# EAGLE board 1907022249-Dev Board (EAGLE 9.4.2)
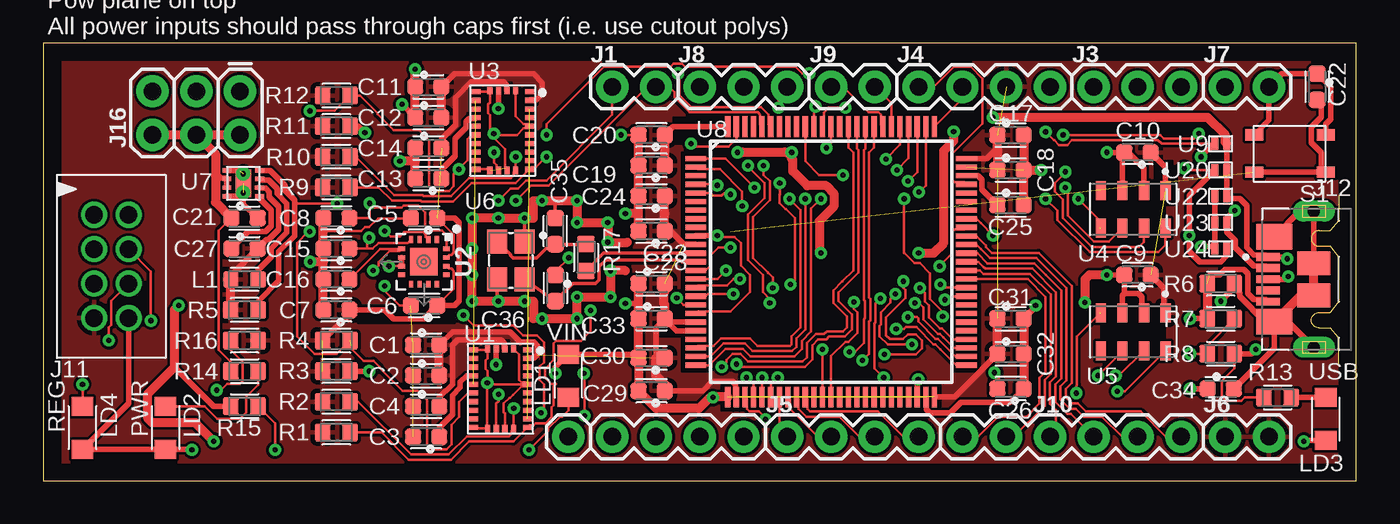
[diagram p3: board, top side]
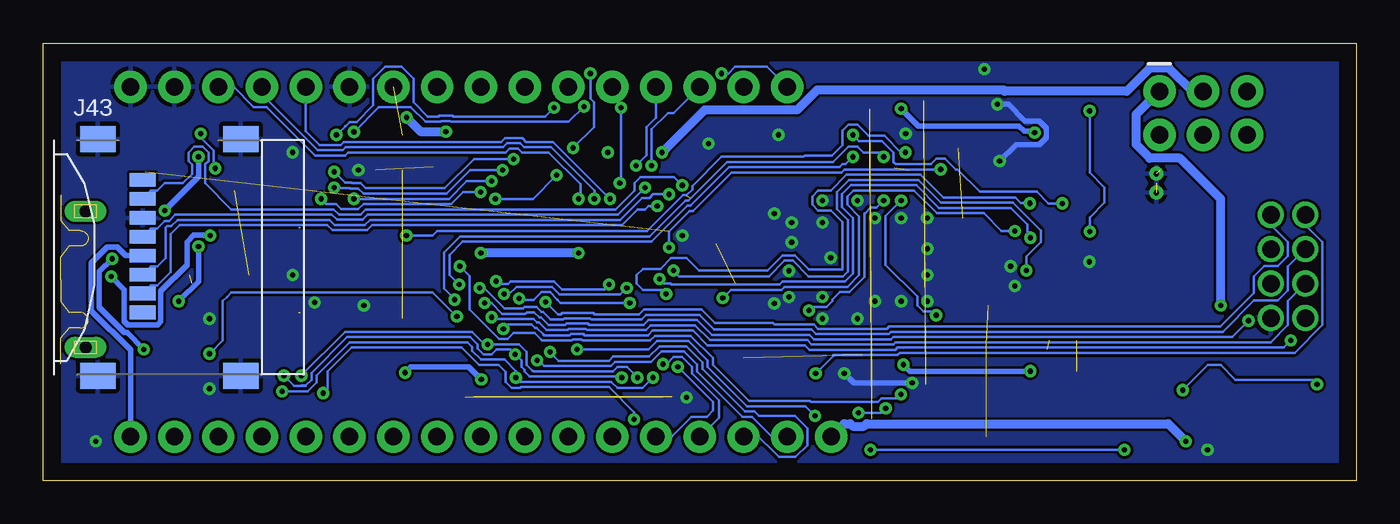
[diagram p4: board, bottom side, seen from below]

Size 76.2 x 25.4 mm. Coordinates in mm from the lower left corner, seen from the top.
Outline: 0,0 76.2,0 76.2,25.4 0,25.4 0,0
Copper layers (1*16): Top 0.035mm / dielectric 1.5mm / Bottom 0.035mm
Design rules "default *": minimum track width 6mil, minimum drill 0.3mm, track to track 6mil, track to pad 6mil, pad to pad 6mil, via to via 6mil, smd to smd 6mil, copper to edge 40mil, drill to drill 6mil, minimum pad ring 10mil, minimum via ring 8mil, stop-mask expansion 4mil, vias tented up to drill 0mil, thermal gap 10mil

## Footprints (pad centres in the part's own frame; a part is rotated, then mirrored left to right if it is on the bottom)
CAPC1608X95N = smd 0.95 x 0.97: 1 -0.76,0; 2 0.76,0
1X02 = drill 1.016 pad 1.88: 1 0,0; 2 2.54,0
1X04 = drill 1.016 pad 1.88: 1 0,0; 2 2.54,0; 3 5.08,0; 4 7.62,0
1X03 = drill 1.016 pad 1.88: 1 0,0; 2 2.54,0; 3 5.08,0
1X06 = drill 1.016 pad 1.88: 1 0,0; 2 2.54,0; 3 5.08,0; 4 7.62,0; 5 10.16,0; 6 12.7,0
87831-0819 = drill 1.016: 1 8.325,4.15; 2 6.325,4.15; 3 4.325,4.15; 4 2.325,4.15; 5 8.325,2.15; 6 6.325,2.15; 7 4.325,2.15; 8 2.325,2.15
MOLEX_105164-0001 = smd 0.45 x 1.38: 1 1.3,4.11; 2 0.65,4.11; 3 0,4.11; 4 -0.65,4.11; 5 -1.3,4.11 | drill 0.7 long: SH1 -3.95,1.45; SH6 3.95,1.45 | smd 1.475 x 2.1: SH2 -2.462,3.75; SH5 2.462,3.75 | smd 1.375 x 1.9: SH3 -0.938,1.45; SH4 0.938,1.45
1X01 = drill 1.016 pad 1.88: 1 0,0
2X3 = drill 1.016 pad 1.88: 1 0,0; 2 0,2.54; 3 2.54,0; 4 2.54,2.54; 5 5.08,0; 6 5.08,2.54
MOLEX_47219-2001 = smd 0.8 x 1.5: 1 3.2,-2.1; 2 2.1,-2.1; 3 1,-2.1; 4 -0.1,-2.1; 5 -1.2,-2.1; 6 -2.3,-2.1; 7 -3.4,-2.1; 8 -4.5,-2.1 | smd 1.5 x 2.05: G1 6.875,-4.7; G2 6.875,3.6; G3 -6.875,3.6; G4 -6.875,-4.7
INDC1608X95N = smd 0.9 x 0.97: 1 -0.785,0; 2 0.785,0
0805_LED = smd 1.1 x 1.25: A 0,0; C 2.5,0
RESC1608X50N = smd 0.94 x 1.02: 1 -0.79,0; 2 0.79,0
SKRPANE010 = smd 1.05 x 0.65: 1 0,2.15; 2 4.15,2.15; 3 0,0; 4 4.15,0
LGA28R50P4X10_380X520X100 = smd 0.3 x 0.525: 1 -2.25,1.562; 6 -2.25,-1.562; 7 -1.75,-1.562; 8 -1.25,-1.562; 9 -0.75,-1.562; 10 -0.25,-1.562; 11 0.25,-1.562; 12 0.75,-1.562; 13 1.25,-1.562; 14 1.75,-1.562; 15 2.25,-1.562; 20 2.25,1.562; 21 1.75,1.562; 22 1.25,1.562; 23 0.75,1.562; 24 0.25,1.562; 25 -0.25,1.562; 26 -0.75,1.562; 27 -1.25,1.562; 28 -1.75,1.562 | smd 0.425 x 0.3: 2 -2.312,0.75; 3 -2.312,0.25; 4 -2.312,-0.25; 5 -2.312,-0.75; 16 2.312,-0.75; 17 2.312,-0.25; 18 2.312,0.25; 19 2.312,0.75
LFCSP-16-3X3 = smd 0.4 x 0.25: 1 -1.3,0.75; 2 -1.3,0.25; 3 -1.3,-0.25; 4 -1.3,-0.75; 9 1.3,-0.75; 10 1.3,-0.25; 11 1.3,0.25; 12 1.3,0.75 | smd 0.25 x 0.4: 5 -0.75,-1.3; 6 -0.25,-1.3; 7 0.25,-1.3; 8 0.75,-1.3; 13 0.75,1.3; 14 0.25,1.3; 15 -0.25,1.3; 16 -0.75,1.3 | smd 1.6 x 1.6: EXP 0,0
TE_MS860702BA01-50 = smd 1.1 x 0.6: 1 -1.1,1.875; 2 -1.1,0.625; 3 -1.1,-0.625; 4 -1.1,-1.875; 5 1.1,-1.875; 6 1.1,-0.625; 7 1.1,0.625; 8 1.1,1.875
TSX-3225 = smd 1.4 x 1.15: 1 0,0; 2 2.2,0; 3 2.2,1.6; 4 0,1.6
TPS62172 = smd 0.5 x 0.25: 1 -0.01,1.5; 2 -0.01,1; 3 -0.01,0.5; 4 -0.01,0; 5 1.9,0; 6 1.9,0.5; 7 1.9,1; 8 1.9,1.5 | smd 0.9 x 1.6: THERMAL@1 0.95,0.75 | drill 0.3: THERMAL@2 0.95,1.3; THERMAL@3 0.95,0.2
LQFP100_14X14 = smd 1.2 x 0.3: 1 -7.85,6; 2 -7.85,5.5; 3 -7.85,5; 4 -7.85,4.5; 5 -7.85,4; 6 -7.85,3.5; 7 -7.85,3; 8 -7.85,2.5; 9 -7.85,2; 10 -7.85,1.5; 11 -7.85,1; 12 -7.85,0.5; 13 -7.85,0; 14 -7.85,-0.5; 15 -7.85,-1; 16 -7.85,-1.5; 17 -7.85,-2; 18 -7.85,-2.5; 19 -7.85,-3; 20 -7.85,-3.5; 21 -7.85,-4; 22 -7.85,-4.5; 23 -7.85,-5; 24 -7.85,-5.5; 25 -7.85,-6; 51 7.85,-6; 52 7.85,-5.5; 53 7.85,-5; 54 7.85,-4.5; 55 7.85,-4; 56 7.85,-3.5; 57 7.85,-3; 58 7.85,-2.5; 59 7.85,-2; 60 7.85,-1.5; 61 7.85,-1; 62 7.85,-0.5; 63 7.85,0; 64 7.85,0.5; 65 7.85,1; 66 7.85,1.5; 67 7.85,2; 68 7.85,2.5; 69 7.85,3; 70 7.85,3.5; 71 7.85,4; 72 7.85,4.5; 73 7.85,5; 74 7.85,5.5; 75 7.85,6 | smd 0.3 x 1.2: 26 -6,-7.85; 27 -5.5,-7.85; 28 -5,-7.85; 29 -4.5,-7.85; 30 -4,-7.85; 31 -3.5,-7.85; 32 -3,-7.85; 33 -2.5,-7.85; 34 -2,-7.85; 35 -1.5,-7.85; 36 -1,-7.85; 37 -0.5,-7.85; 38 0,-7.85; 39 0.5,-7.85; 40 1,-7.85; 41 1.5,-7.85; 42 2,-7.85; 43 2.5,-7.85; 44 3,-7.85; 45 3.5,-7.85; 46 4,-7.85; 47 4.5,-7.85; 48 5,-7.85; 49 5.5,-7.85; 50 6,-7.85; 76 6,7.85; 77 5.5,7.85; 78 5,7.85; 79 4.5,7.85; 80 4,7.85; 81 3.5,7.85; 82 3,7.85; 83 2.5,7.85; 84 2,7.85; 85 1.5,7.85; 86 1,7.85; 87 0.5,7.85; 88 0,7.85; 89 -0.5,7.85; 90 -1,7.85; 91 -1.5,7.85; 92 -2,7.85; 93 -2.5,7.85; 94 -3,7.85; 95 -3.5,7.85; 96 -4,7.85; 97 -4.5,7.85; 98 -5,7.85; 99 -5.5,7.85; 100 -6,7.85
SOD882 = smd 0.4 x 0.7: 1 -0.35,0; 2 0.35,0

## Placement (x,y rotation side)
C1  120nF  [CAPC1608X95N]  22.23,7.87 0 top
C2  6.8nF  [CAPC1608X95N]  22.23,6.1 0 top
C3  100nF  [CAPC1608X95N]  22.23,2.54 180 top
C4  100nF  [CAPC1608X95N]  22.23,4.32 0 top
C5  100nF  [CAPC1608X95N]  22.1,15.24 180 top
C6  100nF  [CAPC1608X95N]  22.1,10.16 180 top
C7  10uF  [CAPC1608X95N]  17.02,9.91 180 top
C8  .005uF  [CAPC1608X95N]  17.02,15.24 180 top
C9  100nF  [CAPC1608X95N]  63.5,11.94 180 top
C10  100nF  [CAPC1608X95N]  63.5,19.05 180 top
C11  120nF  [CAPC1608X95N]  22.35,22.86 0 top
C12  6.8nF  [CAPC1608X95N]  22.35,21.08 0 top
C13  100nF  [CAPC1608X95N]  22.35,17.53 180 top
C14  100nF  [CAPC1608X95N]  22.35,19.3 0 top
C15  .005uF  [CAPC1608X95N]  17.02,13.46 180 top
C16  .005uF  [CAPC1608X95N]  17.02,11.68 180 top
C17  100nF  [CAPC1608X95N]  56.13,20.07 0 top
C18  4.7uF  [CAPC1608X95N]  56.13,18.03 0 top
C19  100nF  [CAPC1608X95N]  35.31,18.29 180 top
C20  4.7uF  [CAPC1608X95N]  35.31,20.07 180 top
C21  10 uF  [CAPC1608X95N]  11.68,15.24 0 top
C22  100nF  [CAPC1608X95N]  73.91,22.86 270 top
C23  100nF  [CAPC1608X95N]  35.31,14.48 180 top
C24  4.7uF  [CAPC1608X95N]  35.31,16.51 180 top
C25  2.2uF  [CAPC1608X95N]  56.13,16 0 top
C26  2.2uF  [CAPC1608X95N]  56.13,5.33 180 top
C27  22uF  [CAPC1608X95N]  11.68,13.46 0 top
C28  1uF  [CAPC1608X95N]  35.31,11.43 0 top
C29  100nF  [CAPC1608X95N]  35.31,5.21 180 top
C30  4.7uF  [CAPC1608X95N]  35.31,7.11 180 top
C31  100nF  [CAPC1608X95N]  56.13,9.4 0 top
C32  4.7uF  [CAPC1608X95N]  56.13,7.37 0 top
C33  10nF  [CAPC1608X95N]  35.31,9.4 0 top
C34  4.7nF  [CAPC1608X95N]  68.33,5.33 0 top
C35  8pF  [CAPC1608X95N]  29.72,14.48 90 top
C36  8pF  [CAPC1608X95N]  29.72,11.18 270 top
J1  I2C1  [1X02]  33.02,22.86 0 top
J2  P0-P3  [1X04]  33.02,2.54 0 top
J3  A0-A3  [1X03]  60.96,22.86 0 top
J4  Debug  [1X04]  50.8,22.86 0 top
J5  P4-P7  [1X04]  43.18,2.54 0 top
J6  VCC  [1X02]  68.58,2.54 0 top
J7  GND  [1X02]  68.58,22.86 0 top
J8  SPI1  [1X03]  38.1,22.86 0 top
J9  UART5  [1X02]  45.72,22.86 0 top
J10  P8-P13  [1X06]  53.34,2.54 0 top
J11  [87831-0819]  7.11,7.11 90 top
J12  105164-0001  [MOLEX_105164-0001]  75.18,11.68 90 top
J13  VIN  [1X01]  30.48,2.54 0 top
J16  Header 3x2  [2X3]  11.43,22.61 180 top
J43  47219-2001  [MOLEX_47219-2001]  68.33,12.95 270 bottom
L1  2.2uH  [INDC1608X95N]  11.68,11.68 180 top
LD1  VIN  [0805_LED]  30.48,4.83 90 top
LD2  PWR  [0805_LED]  7.11,4.32 270 top
LD3  USB  [0805_LED]  74.42,4.83 270 top
LD4  REG  [0805_LED]  2.29,4.32 270 top
R1  40kΩ  [RESC1608X50N]  17.02,2.79 180 top
R2  40kΩ  [RESC1608X50N]  17.02,4.57 180 top
R3  10kΩ  [RESC1608X50N]  17.02,6.35 180 top
R4  10kΩ  [RESC1608X50N]  17.02,8.13 180 top
R5  100k  [RESC1608X50N]  11.68,9.91 180 top
R6  1M  [RESC1608X50N]  68.33,11.43 180 top
R7  59k  [RESC1608X50N]  68.33,9.4 0 top
R8  42.2k  [RESC1608X50N]  68.33,7.37 0 top
R9  40kΩ  [RESC1608X50N]  17.02,17.02 180 top
R10  40kΩ  [RESC1608X50N]  17.02,18.8 180 top
R11  10kΩ  [RESC1608X50N]  17.02,20.57 180 top
R12  10kΩ  [RESC1608X50N]  17.02,22.35 180 top
R13  [RESC1608X50N]  71.63,4.83 0 top
R14  [RESC1608X50N]  11.68,6.35 0 top
R15  [RESC1608X50N]  11.68,4.32 0 top
R16  [RESC1608X50N]  11.68,8.13 180 top
R17  [RESC1608X50N]  31.5,12.95 270 top
S1  SKRPANE010  [SKRPANE010]  74.42,20.07 180 top
U1  BNO055  [LGA28R50P4X10_380X520X100]  26.54,5.33 270 top
U2  ADXL377  [LFCSP-16-3X3]  22.1,12.7 270 top
U3  BNO055  [LGA28R50P4X10_380X520X100]  26.67,20.32 270 top
U4  MS5607-02BA03  [TE_MS860702BA01-50]  63.25,15.75 270 top
U5  MS5607-02BA03  [TE_MS860702BA01-50]  63.25,8.64 270 top
U6  TSX-3225  [TSX-3225]  27.94,11.68 90 top
U7  TPS62172  [TPS62172]  10.67,16.51 0 top
U8  STM32F767VIT6  [LQFP100_14X14]  45.72,12.7 0 top
U9  PESD3V3S1UL  [SOD882]  68.33,19.56 0 top
U20  PESD3V3S1UL  [SOD882]  68.33,18.03 0 top
U22  PESD3V3S1UL  [SOD882]  68.33,16.51 0 top
U23  PESD3V3S1UL  [SOD882]  68.33,14.99 0 top
U24  PESD3V3S1UL  [SOD882]  68.33,13.46 0 top

## Tracks (layer width: path | path; a pad name or v marks a point on that pad's centre or on a via)
3V3  (8 unrouted)
  Top 0.152: C30.1 35.56,7.11 35.76,7.11 | 40.13,4.76 U8.27 | C5.1 | U2.15 23.54,13.1 23.69,13.1 23.83,13.23 23.83,14.27 23.11,14.99 | U2.14 23.54,12.3 23.69,12.3 23.83,12.17 23.83,11.13 C6.1 | C7.1 17.78,9.68
  Top 0.203: 39.72,20.99 U8.100
  Top 0.305: C9.1 64.77,11.43 65.02,11.18 65.02,9.83 U5.1 | 36.41,14.48 C23.1 36.41,14.48 | C33.2 36.26,9.2 U8.20 | C33.2 36.76,8.7 U8.21 | U8.27 40.18,4.89 40.18,5.57 40,5.75 38.83,5.75 38.28,5.21 C29.1 | C32.1 54.48,6.47 54.48,6.42 52.9,4.85 U8.50 | 55.37,19.3 54.77,18.7 U8.75 | U8.11 37.83,13.74 37.15,13.74 36.41,14.48 | C20.1 36.55,20.55 U8.100 | C14.2 23.11,19.81 23.93,20.63 23.93,22.24 24.84,23.15 26.7,23.15 26.88,22.97 26.88,22.68 U3.3 | U1.3 26.75,7.69 26.75,7.99 26.57,8.16 24.72,8.16 24.04,8.16 23.75,7.87 23.75,5.59 22.98,4.82 C4.2 | C1.2 23.75,8.64 27.1,8.64 27.71,8.03 27.72,8.04 28.49,8.04 28.67,7.86 28.67,7.31 28.59,7.22 28.49,7.13 28.15,7.13 U1.28 | C11.2 23.87,23.62 28.45,23.62 28.96,23.11 28.96,22.45 28.62,22.11 28.28,22.11 U3.28 | C5.1 | 23.11,14.99 C5.1 | C5.1 | 12.57,16.98 12.9,16.98 13.12,16.76 13.12,16.46 13.68,15.9 13.68,14.58 13.1,13.99 12.97,13.99 C27.2 10.9,11.92 L1.2 | U4.1 65.12,18.19 C10.1 | R4.2 17.78,9.68 C7.1 19.81,9.91 20.35,9.37 22.07,9.37 C6.1 23.88,10.16 24.13,10.41 24.13,14.99 23.88,15.24 C5.1 | C33.2 35.56,8.89 35.56,7.11
  Top 0.508: C29.1 36.07,5.59 35.56,6.1 35.56,7.11 | C32.1 C31.1 | C18.1 55.37,19.3 C17.1 | C20.1 C19.1 | C23.1 36.07,15.49 C24.1 | C12.2 C11.2 | C2.2 C1.2 | R5.2 L1.2 | C28.2 36.07,10.97 36.01,10.91 36.01,10.28 36.07,10.22 C33.2
  Bottom 0.305: J43.4 71.41,13.05 71.91,13.56 72.48,13.56 73.39,12.65 73.39,9.85 71.12,7.57 J6.2
  pour Top: 1.02,24.64 75.44,24.64 75.44,0.76 1.02,0.76
A0_PA1  (via drill 0.3)
  Top 0.152: v43.31,16.36 43.94,15.72 43.94,8.9 43.41,8.37 43.41,7.9 43.34,7.82 41.45,7.82 41.02,8.25 39.34,8.25 38.91,7.82 37.99,7.82 U8.23
  Bottom 0.152: v43.31,16.36 46.61,19.66 48.16,19.66 48.39,19.89 49.4,19.89 49.62,19.66 58.77,19.66 58.94,19.48 60.15,19.48 60.96,20.3 J3.1
A1_PA2  (via drill 0.3)
  Top 0.152: v44.22,16.36 44.25,16.32 44.25,8.77 43.72,8.24 43.72,7.77 43.46,7.52 41.16,7.52 40.73,7.95 39.47,7.95 38.72,7.2 U8.24
  Bottom 0.152: J3.2 63.5,22.4 60.28,19.18 58.81,19.18 58.64,19.36 49.5,19.36 49.27,19.58 48.52,19.58 48.29,19.36 46.74,19.36 44.22,16.83 v44.22,16.36
A2_PA3  (via drill 0.3)
  Top 0.152: v45.12,16.36 44.55,15.78 44.55,8.64 44.02,8.11 44.02,7.65 43.59,7.21 41.03,7.21 40.6,7.64 39.59,7.64 38.79,6.84 38.79,6.6 38.7,6.7 U8.25
  Bottom 0.152: J3.3 65.15,22.86 63.98,21.69 63.22,21.69 60.4,18.88 58.69,18.88 58.51,19.05 49.37,19.05 49.15,19.28 48.64,19.28 48.42,19.05 46.86,19.05 45.02,17.21 45.02,16.46 v45.12,16.36
ADRSEL1_PA8  (via drill 0.3)
  Top 0.152: v52.02,12.45 52.74,13.17 52.74,14.45 52.88,14.58 53.45,14.58 U8.67 | v26.43,5 26.43,4.61 26.29,4.47 U1.17
  Bottom 0.152: 51.46,11.13 51.46,11.18 | 51.46,11.18 51.46,11.89 v52.02,12.45 | 47.32,8.2 47.25,8.13 | 47.25,8.13 45.53,8.13 45.45,8.2 44.97,8.2 44.9,8.13 40.98,8.13 40.7,8.4 38.63,8.4 37.34,7.12 37.34,6.72 35.24,4.62 31.7,4.62 31.65,4.57 27.77,4.57 27.55,4.78 26.65,4.78 v26.43,5 | 47.25,8.13 47.69,8.56 48.91,8.56 49.26,8.22 49.74,8.22 51.46,9.94 51.46,11.18
ADRSEL2_PA9  (via drill 0.3)
  Top 0.152: v55.12,14.22 54.4,14.94 54.4,14.95 54.14,15.2 U8.68 | U3.17 26.3,18.13 26.3,18.32 26.16,18.45 v26.16,19.05
  Bottom 0.152: v55.12,14.22 53.59,14.22 53.34,14.48 41.15,14.48 39.06,16.56 38.88,16.56 38.53,16.9 38.53,17.09 36.83,18.8 32.08,18.8 32,18.87 30.42,18.87 29.82,19.48 29.82,20.32 29.46,20.67 28.96,20.67 28.3,20.01 27.39,20.01 26.43,19.05 v26.16,19.05
BL_IND  (1 unrouted)
CS1_PA4  (via drill 0.3)  (1 unrouted)
  Top 0.152: v41.91,3.56 41.91,3.66 41.55,4.02 40.98,4.02 40.84,4.16 40.84,4.73 U8.28 | v59.94,5.08 59.94,5.51 59.99,5.56 59.99,8.38 61.3,9.68 61.3,9.74
  Bottom 0.152: v59.94,5.08 59.69,5.33 59.69,6.33 58.3,7.72 51.91,7.72 50.91,6.71 49.78,6.71 49.38,6.31 49.38,5.73 49.02,5.37 48.52,5.37 48.45,5.44 43.37,5.44 41.91,3.97 v41.91,3.56
CS2_PB12  (via drill 0.3)
  Top 0.152: J11.7 3.95,10.43 3.95,9.03 3.81,8.88 v3.81,8.13 | U8.51 52.99,6.7 52.07,7.62 51.77,7.92 51.66,7.92 50.66,8.91 50.06,8.91 49.95,8.8 v49.49,8.8
  Bottom 0.152: v3.81,8.13 4.22,7.72 26.62,7.72 26.75,7.6 31.73,7.6 31.99,7.85 37.64,7.85 38.5,8.71 40.83,8.71 41.1,8.43 44.77,8.43 44.84,8.51 45.58,8.51 45.66,8.43 47.12,8.43 47.2,8.5 47.56,8.87 47.66,8.87 47.87,9.07 49.22,9.07 v49.49,8.8
CS3_PA15  (via drill 0.3)  (1 unrouted)
  Top 0.152: v50.82,16.74 51.22,17.14 U8.77 | v60.07,16.36 61.3,15.13 61.3,14.65
  Bottom 0.152: v50.82,16.74 51.84,16.74 52.53,16.05 57.61,16.05 57.91,15.75 58.9,15.75 59.2,16.05 59.77,16.05 v60.07,16.36
CS4_PE3  (via drill 0.3)
  Top 0.152: 37.99,18.08 U8.2 37.99,18.08 | 37.99,18.08 39.27,18.08 40.56,16.79 v40.56,15.93
  Bottom 0.152: J43.2 69.95,11.32 69.58,11.32 68.78,12.12 68.78,14.32 68.27,14.83 59.71,14.83 59.41,14.53 57.41,14.53 57.11,14.83 42.6,14.83 41.7,15.72 41.28,15.72 41.07,15.93 v40.56,15.93
CUTOUT
  cutout Top: 37.08,19.05 38.73,19.05 38.73,6.35 37.08,6.35
  cutout Top: 25.53,20.83 25.53,21.34 24.64,21.34 24.64,20.83
  cutout Top: 18.29,10.16 21.59,10.16 22.35,10.92 22.86,10.92 23.11,11.18 23.11,14.22 22.86,14.48 22.1,14.48 22.1,16 24.64,16 24.64,9.91 23.88,9.14 18.29,9.14
  cutout Top: 65.53,16 64.52,16 64.52,17.53 64.52,18.03 64.52,18.29 64.77,18.54 65.53,18.54 65.53,18.03 65.79,17.78 65.79,17.53 65.79,16
  cutout Top: 38.61,8.38 38.61,9.4 36.83,9.4 36.83,10.92 35.81,10.92 35.81,8.38
  cutout Top (isolate 0.254): 39.37,21.08 36.58,21.08 36.58,19.56 39.37,19.56
CUTOUT1
  cutout Top: 39.37,19.68 39.37,21.34 52.07,21.34 52.07,19.68
CUTOUT2
  cutout Top: 39.37,4.06 39.37,5.71 52.07,5.71 52.07,4.06
CUTOUT3
  cutout Top: 54.36,6.35 52.7,6.35 52.7,19.05 54.36,19.05
CUTOUT4
  cutout Top: 27.18,23.11 26.67,23.11 26.67,22.23 27.18,22.23
CUTOUT5
  cutout Top: 28.7,21.84 28.7,22.35 27.81,22.35 27.81,21.84
CUTOUT6
  cutout Top: 27.05,8.13 26.54,8.13 26.54,7.24 27.05,7.24
CUTOUT7
  cutout Top: 27.81,7.37 27.81,6.86 28.7,6.86 28.7,7.37
GND  (via drill 0.3)  (10 unrouted)
  Top 0.152: C30.2 | C36.1 29.72,12.15 v30.5,12.93 | 34.55,11.18 C28.1 | U3.15 25.86,18.07 U3.16 | 27.88,20.45 27.94,20.45 | 27.94,20.45 28.11,20.45 U3.25 28.11,20.69 27.88,20.69 27.42,21.15 U3.2 | U3.6 25.86,22.57 U3.5 25.92,21.95 25.81,21.84 25.81,21.34 25.92,21.23 25.92,20.38 v26.16,20.14 26.16,20.07 | U1.16 25.65,3.02 | 25.65,3.02 25.04,3.02 U1.15 | U1.25 28.11,5.5 28.07,5.46 27.75,5.46 27.27,4.99 27.09,4.81 27.06,4.81 26.73,4.47 26.73,3.96 26.79,3.9 U1.18 | U1.2 27.61,7.33 27.61,5.84 27.75,5.71 27.98,5.71 U1.25 | U1.6 25.73,7.58 U1.5 25.79,7.09 25.68,6.98 25.68,6.48 25.79,6.37 25.79,5.69 | 25.79,5.69 v25.77,5.67 25.77,3.14 25.65,3.02 | U2.7 v20.07,12.45 | C6.2 20.67,10.16 19.81,11.02 v19.81,11.3 | 26.8,18.13 U3.18 26.8,18.13 | 27.94,20.45 27.88,20.45 | 26.16,20.07 27.49,20.07 27.88,20.45 | U8.19 37.99,9.82 39.89,9.82 41.01,10.94 41.01,11.95 40.48,12.47 40.48,13.78 40.13,14.13 39.21,14.13 v39.12,14.22 | C20.2 v33.53,20.07 | U8.99 40.22,19.84 39.78,19.4 37.75,19.4 v37.59,19.56 | 16.26,14.48 18.45,14.48 18.67,14.71 18.93,14.71 19.44,15.22 21.32,15.22 C5.2 | 26.16,20.07 26.16,19.88 26.8,19.24 26.8,18.13 | U1.25 25.89,5.58 25.79,5.69
  Top 0.203: C35.2 29.72,16.26 | C36.1 29.72,12.15 | U6.2 v27.94,15.24 | U6.4 26.34,10.59 26.16,10.41 | C23.2 34.29,14.48
  Top 0.305: U2.6 U2.7 | v61.72,11.94 C9.2 62.74,10.87 | C10.2 v61.72,19.05 | U8.10 37.89,14.22 v39.12,14.22 | 38.89,4.85 v38.86,4.83 | 67.69,11.94 68.27,11.94 68.58,12.24 69.09,12.24 | 69.66,12.24 69.09,12.24 | U7.4 11.42,16.51 U7.THERMAL@3 11.62,16.07 C21.2 | U7.1 11.42,18.01 | C34.1 v66.55,5.33 | R7.1 v66.55,9.4 | U4.2 63.87,18.15 62.97,19.05 C10.2 | U4.3 62.62,18.93 C10.2 | C31.2 57.58,10.09 v57.58,10.16 | U5.3 62.62,10.75 62.74,10.87 | U5.2 63.75,9.85 63.75,10.67 63.55,10.87 62.74,10.87 | U8.49 51.26,4.81 51.26,4.13 51.44,3.94 52.64,3.94 53.24,4.54 56.1,4.54 C26.1 | J12.5 70.95,10.5 70.26,10.5 69.89,10.87 69.89,12.01 69.66,12.24 | 69.66,12.24 69.09,12.24 | S1.3 74.42,20.7 74.7,20.98 74.7,22.83 C22.1 73.66,23.62 71.88,23.62 J7.2 71.12,20.91 S1.4 | v8.64,1.78 8.6,1.82 LD2.C LD4.C 4.96,4.49 J11.8 | LD3.C 73.19,2.33 v73.15,2.29 | v29.72,6.22 29.72,6.56 LD1.C 34.33,7.33 C30.2 | C12.1 v20.83,21.84 | 34.55,10.29 v33.78,10.29
  Top 0.508: 33.79,12.18 v32.93,12.18 v32.93,10.67 v30.99,10.67 v30.99,9.4 v28.96,9.4 28.45,9.4 28.45,10.41 v27.94,10.41 v26.42,10.41 26.16,10.41 v24.89,10.41 24.89,11.68 v24.89,11.94 v24.89,13.46 24.89,15.2 v24.9,15.24 v26.42,15.24 v27.94,15.24 28.45,15.24 28.45,16.26 v28.96,16.26 29.72,16.26 29.97,16.26 v30.99,16.26 v30.99,14.99 v32.77,14.99 v32.77,13.83 33.9,13.83 | 34.55,11.18 34.55,10.29 C33.1 C30.2 C29.2 35.56,4.19 38.05,4.19 38.69,4.83 v38.86,4.83 | C23.2 34.55,15.24 34.55,15.49 | 34.55,15.49 C24.2 C19.2 C20.2 | C31.2 C32.2 C26.1 | C25.2 C18.2 | C17.2 C18.2 | C18.2 v57.91,18.03 | R6.2 R7.1 | C13.2 21.59,18.54 | 21.59,18.54 C14.1 | C12.1 C11.1 v21.59,23.87 v21.59,23.88 | 21.59,18.54 v20.7,18.54 | C7.2 C16.2 16.26,12.7 | 16.26,12.7 C15.2 16.26,14.48 C8.2 | 16.26,12.7 v15.49,12.7 | C28.1 34.55,10.67 | v61.72,11.94 60.71,11.94 60.45,11.68 v60.45,10.34 | 34.55,15.49 v33.78,15.49 | U8.26 38.89,4.85
  Bottom 0.305: v25.77,5.67 29.16,5.67 v29.72,6.22 | v20.7,18.54 19.73,19.51 18.39,19.51 17.99,19.91 17.99,20.48 18.39,20.88 19.23,20.88 20.19,21.84 v20.83,21.84
  pour Bottom: 0.51,24.89 75.69,24.89 75.69,0.51 0.51,0.51
MISO1_PA6  (via drill 0.3)
  Top 0.152: U8.30 v41.72,5.98 | v41.8,18.29 41.8,17.74 42.16,17.39 42.16,16.27 41.2,15.31 41.2,14.22 | 41.2,14.22 41.2,14.17 | v49.45,10.83 49.17,10.55 49.17,10.33 48.61,9.77 48.61,9.05 48.54,8.98 48.54,8.38 49.01,7.91 v50.41,7.91 | 42.05,12.07 41.2,12.92 41.2,14.22 | 42.05,12.07 42.06,12.06 | 42.05,12.07 42.34,11.79 v42.34,11.18 | U5.6 62.62,7.5 v61.21,6.1
  Bottom 0.152: 60.96,6.35 v61.21,6.1 58.67,8.64 51.31,8.64 50.58,7.91 v50.41,7.91 49.78,7.91 | v41.72,5.98 42.33,6.59 42.88,6.59 43.12,6.35 47.75,6.35 47.77,6.37 47.79,6.37 48.15,6.72 48.15,7.48 48.58,7.91 49.13,7.91 49.78,7.91 | v41.8,18.29 41.2,18.89 41.2,20.52 40.64,21.08 J8.2 | v42.34,11.18 42.71,10.8 46.22,10.8 46.67,11.25 48.73,11.25 49.18,10.8 49.42,10.8 v49.45,10.83 | 49.78,7.91 49.86,7.91
MISO2_PB14  (via drill 0.3)
  Top 0.152: v6.25,9.29 6.25,12.14 J11.6 | U8.53 52.85,7.7 52.25,8.3 52.03,8.52 51.91,8.52 51.08,9.35 51.08,10.05 50.82,10.31 v50.58,10.31
  Bottom 0.152: v6.25,9.29 7.21,8.33 26.88,8.33 27,8.21 31.48,8.21 31.74,8.46 37.39,8.46 38.25,9.32 38.61,9.32 41.08,9.32 41.36,9.04 44.52,9.04 44.59,9.12 45.83,9.12 45.91,9.04 46.87,9.04 47.31,9.48 47.41,9.48 47.7,9.77 48.13,9.77 48.22,9.69 49.56,9.69 50.19,10.31 v50.58,10.31
MISO3_PC11  (via drill 0.3)
  Top 0.152: v49.54,18.03 50.22,18.71 U8.79 | v59.31,17.02 59.46,16.86 59.46,15.38 60.98,13.87 61.84,13.87 U4.6
  Bottom 0.152: v49.54,18.03 51.42,18.03 52.78,16.66 57.61,16.66 57.91,16.96 58.4,16.96 58.41,16.98 59.27,16.98 v59.31,17.02
MISO4_PE5  (via drill 0.3)
  Top 0.152: U8.4 39.06,17.2 v39.12,17.14
  Bottom 0.152: v39.12,17.14 39.6,17.62 41.53,17.62 41.88,17.27 41.88,16.84 42.98,15.75 57.49,15.75 57.79,15.45 59.03,15.45 59.33,15.75 65.28,15.75 66.79,17.26 66.79,18.37 66.6,18.55 66.6,19.04 66.94,19.38 67.42,19.38 67.77,19.04 67.77,18.55 67.56,18.35 67.56,17.8 68.1,17.26 69.15,17.26 69.58,16.82 69.95,16.82 J43.7
MOSI1_PA7  (via drill 0.3)
  Top 0.152: U8.31 42.22,5.57 v42.63,5.98 | v62.23,6.1 62.43,6.1 U5.7 | J8.3 42.67,22.35 v42.67,21.66 | v42.74,17.27 42.74,16.61 42.73,16.6 42.73,16.11 43.07,15.77 43.1,15.77 43.64,15.24 43.64,11.66 v43.36,11.38 | v48.81,7.33 50.65,7.33 50.99,7.67 50.99,8.15 50.65,8.49 50.17,8.49 49.89,8.21 49.14,8.21 48.91,8.44 48.91,9.47 50.03,10.59 50.03,11.07 49.92,11.18 v49.92,11.57
  Bottom 0.152: v42.63,5.98 42.69,6.04 47.97,6.04 48.27,6.34 48.27,6.41 48.45,6.59 48.45,6.96 v48.81,7.32 | 61.21,5.49 61.62,5.49 v62.23,6.1 | 61.21,5.49 60.96,5.49 | 61.21,5.49 61.19,5.51 60.97,5.51 60.63,5.86 60.63,6.25 58.55,8.33 51.43,8.33 50.99,7.89 50.99,7.67 50.65,7.33 50.17,7.33 49.89,7.61 49.1,7.61 v48.81,7.32 | v42.67,21.66 42.67,17.34 v42.74,17.27 | v43.36,11.38 43.64,11.11 46.1,11.11 46.55,11.55 48.77,11.55 | 48.77,11.55 48.86,11.55 | v48.81,7.32 v48.81,7.33 | v49.92,11.57 49.77,11.41 49.21,11.41 49.06,11.55 48.77,11.55
MOSI2_PB15  (via drill 0.3)
  Top 0.152: U8.54 52.78,8.2 52.15,8.83 52.04,8.83 51.39,9.48 51.39,10.18 51.16,10.41 51.16,10.9 v50.88,11.18
  Bottom 0.152: J11.2 3.97,12.43 3.97,11.03 4.55,10.45 5.95,10.45 7.76,8.64 27,8.64 27.13,8.51 31.36,8.51 31.61,8.77 37.26,8.77 38.12,9.62 41.21,9.62 41.48,9.35 44.39,9.35 44.47,9.42 45.96,9.42 46.03,9.35 46.74,9.35 47.18,9.78 47.28,9.78 47.58,10.08 48.26,10.08 48.35,9.99 49.43,9.99 50.62,11.18 v50.88,11.18
MOSI3_PC12  (via drill 0.3)
  Top 0.152: v48.9,18.67 49.72,19.49 U8.80 | v59.31,17.93 59.31,17.88 58.7,17.27 58.7,16.77 59.16,16.31 59.16,15.26 60.85,13.56 63.58,13.56 63.87,13.85 U4.7
  Bottom 0.152: v48.9,18.67 51.2,18.67 52.91,16.97 57.49,16.97 57.79,17.27 58.27,17.27 58.29,17.29 58.67,17.29 v59.31,17.93
MOSI4_PE6  (via drill 0.3)  (1 unrouted)
  Top 0.152: 38.7,16.45 38.7,16.42 | v39.88,16.62 39.8,16.7 39.53,16.7 39.37,16.54 38.87,16.54 38.7,16.7 U8.5
  Bottom 0.152: J43.3 69.95,12.43 69.58,12.43 69.09,12.92 69.09,14.69 69.01,14.77 68.77,14.77 68.4,15.14 59.58,15.14 59.28,14.84 57.54,14.84 57.23,15.14 42.72,15.14 41.45,16.41 41.02,16.41 40.81,16.62 v39.88,16.62
N$1
  Top 0.305: C3.1 22.98,3.07 23.77,3.85 23.77,4.96 24.21,5.4 24.21,5.71 24.57,6.08 U1.9
N$3  (via drill 0.3)  (1 unrouted)
  Top 0.305: v18.92,6.35 R3.1 | v26.29,6.73 U1.4
  Bottom 0.305: v18.92,6.35 25.91,6.35 v26.29,6.73
N$4
  Top 0.305: C25.1 54.48,16.9 54.48,17.48 54.25,17.7 U8.73
N$5
  Top 0.152: 24.99,20.95 25.07,21.03 U3.9
  Top 0.305: 25.07,21.03 25.06,21.02 24.72,21.02 24.54,20.85 24.54,20.5 23.89,19.85 23.89,18.83 23.11,18.05 C13.1
N$6  (via drill 0.3)
  Top 0.305: v26.42,21.59 U3.4 | R11.1 18.29,20.57 v18.67,20.19
  Bottom 0.305: v26.42,21.59 25.4,20.57 19.57,20.57 19.28,20.28 18.76,20.28 v18.67,20.19
N$7  (via drill 0.3)
  Top 0.152: 50.72,5.82 v50.77,5.87
  Top 0.203: 50.77,4.8 U8.48
  Top 0.305: U8.48 50.72,5.82 | v55.2,6.26 55.37,6.09 C26.2
  Bottom 0.305: v50.77,5.87 51.51,6.6 54.86,6.6 v55.2,6.26
N$8
  Top 0.305: L1.1 12.47,12.23 13.22,12.99 13.22,13.47 14.14,14.39 14.14,16.09 13.58,16.65 13.58,16.95 13.09,17.44 12.64,17.44 U7.7
N$10  (via drill 0.3)
  Top 0.152: R15.2 13.46,3.33 v13.46,1.78 | LD1.A 30.48,4.06 30.12,3.71 30,3.71 29.31,3.02 29.31,2.9 v28.19,1.78
  Bottom 0.152: v13.46,1.78 v28.19,1.78
N$11
  Top 0.152: LD2.A 9.37,4.32 10.11,3.58 11.4,3.58 11.78,3.95 11.78,4.87 12.47,5.57 R14.2
N$12
  Top 0.305: C27.1 11.91,14.45 12.91,14.45 13.22,14.77 13.22,15.71 12.57,16.37 U7.5
N$14  (via drill 0.3)
  Top 0.305: 72.96,12.62 J12.SH4 J12.SH6 72.92,15.63 J12.SH5 | 72.21,9.22 71.63,9.22 | 71.63,9.22 J12.SH2 | U22.1 U23.1 U24.1 67.85,13.59 v67.18,13.59 | v68.33,10.41 69.12,11.2 | 69.12,11.2 R6.1 | C34.2 71.43,7.68 J12.SH2 | J12.SH1 72.25,9.22 71.63,9.22 | 69.12,11.2 69.43,10.89 69.43,10.68 70.89,9.22 J12.SH2
  Top 0.508: J12.SH4 J12.SH3 72.96,10.75 J12.SH2 71.63,9.22 72.25,9.22 | 72.21,14.15 J12.SH5
  Bottom 0.305: v67.18,13.59 67.18,11.56 v68.33,10.41
N$15
  Top 0.203: U6.3 27.11,13.11 27.11,13.08 27.26,12.93 28.62,12.93 29.41,13.72 C35.1 | 29.74,13.74 C35.1 | R17.1 31.47,13.72 C35.1
N$18
  Top 0.152: R14.1 10.89,6.88 10.2,7.58 10.2,14.51 C21.1
  Top 0.305: U7.3 U7.2 10.62,17.55 10.31,17.55 10.14,17.72 10,17.72
  Top 0.508: J16.2 J16.4 | J16.4 J16.6 | J16.4 10,18.95 10,17.72 10,16.16 C21.1
N$20
  Top 0.305: LD3.A R13.2
N$23  (via drill 0.3)
  Top 0.152: LD4.A v2.29,5.59 | R16.2 10.89,7.6 11.59,6.9 11.59,5.8 11.4,5.61 10.69,5.61 10.33,5.25 v10.08,5.25
  Bottom 0.152: v2.29,5.59 2.54,5.84 7.02,5.84 7.88,6.7 8.63,6.7 v10.08,5.25
NRESET  (via drill 0.3)  (2 unrouted)
  Top 0.152: U3.11 24.99,19.95 24.75,19.95 24.62,19.82 24.62,18.6 24.12,18.1 v24.12,18.07 24.09,18.07 23.82,17.8 23.82,17.09 23.54,16.81 22.68,16.81 22.41,17.09 22.41,19.76 21.82,20.34 20.32,20.34 19.4,21.27 19.4,21.33 18.38,22.35 R12.1 16.92,21.46 v15.48,21.46 | 17.93,7.62 18.6,6.96 19.17,6.96 19.53,6.6 19.53,6.53 20.86,5.21 21.72,5.21 22.28,4.65 22.28,2.1 22.55,1.83 23.42,1.83 23.69,2.1 23.69,3.23 24.15,3.69 24.15,4.57 24.66,5.08 U1.11 | v39.88,13.53 39.2,13.53 38.7,13.03 38.7,12.46 38.44,12.2 U8.14 | R4.1 17.05,7.37 15.74,7.37 14.73,8.38 14.73,13.8 15.39,14.46 v15.47,14.46
  Top 0.305: S1.1 74.17,17.92 | 74.17,17.92 S1.2 | C22.2 74.17,21.85 74.17,21.09 73.59,20.52 73.59,19.61 74.17,19.04 74.17,17.92
  Bottom 0.152: v24.12,18.07 24.13,18.06 29.7,18.06 29.88,17.88 36.26,17.88 38.5,15.65 38.68,15.65 39.88,14.46 v39.88,13.53 | v15.48,21.46 15.48,17.87 14.62,17.02 14.62,16.13 15.47,15.28 v15.47,14.46
OSC_IN
  Top 0.203: U8.12 32.53,13.2 R17.2
OSC_OUT
  Top 0.203: U6.1 C36.2 30.74,11.44 32.06,11.44 32.26,11.64 32.26,12.43 32.65,12.82 36.97,12.82 37.08,12.7 U8.13
P0_PD2  (via drill 0.3)
  Top 0.152: U8.83 48.22,19.34 47.93,19.05 47.93,10.62 48,10.55 48,9.31 47.93,9.23 47.93,7.37 v47.54,6.98 v47.54,6.97
  Bottom 0.152: J2.1 33.91,2.54 35.08,3.71 35.62,3.71 38.25,6.34 38.25,6.74 39.01,7.49 40.32,7.49 40.92,6.89 43.01,6.89 43.24,6.66 47.15,6.66 47.46,6.97 v47.54,6.97
P1_PD3  (via drill 0.3)
  Top 0.152: U8.84 47.72,19.27 47.62,19.18 47.62,10.49 47.69,10.42 47.69,9.43 47.62,9.36 47.62,8 47.09,7.47 v46.79,7.47
  Bottom 0.152: v46.79,7.47 46.28,6.96 43.37,6.96 43.13,7.2 41.05,7.2 40.45,7.79 38.88,7.79 37.95,6.86 37.95,6.47 35.49,4.01 34.92,4.01 34.67,3.76 32.59,3.76 31.85,3.02 31.85,2.06 32.54,1.37 33.5,1.37 34.95,2.81 35.56,2.81 J2.2
P2_PD4  (via drill 0.3)
  Top 0.152: U8.85 47.22,19.27 47.32,19.18 47.32,12.19 47.32,12.07 46.15,10.91 46.15,10.43 46.94,9.64 46.94,8.77 46.53,8.36 45.59,8.36 45.44,8.2 44.97,8.2 44.63,7.86 44.63,7.04 44.2,6.6 40.39,6.6 v40.23,6.76
  Bottom 0.152: J2.3 37,3.64 37,4.66 38.56,6.22 38.56,6.61 39.13,7.19 39.62,7.19 40.04,6.76 v40.23,6.76
P3_PD5  (via drill 0.3)
  Top 0.152: U8.86 46.72,19.34 47.01,19.05 47.01,12.7 47.01,12.2 46.36,11.55 | v39.37,6.6 39.65,6.88 39.65,7 39.99,7.34 40.47,7.34 40.9,6.91 44.07,6.91 44.33,7.16 44.33,7.99 44.84,8.51 45.31,8.51 45.47,8.66 46.41,8.66 46.63,8.89 46.63,9.52 45.85,10.3 45.85,11.04 46.36,11.55 | 46.36,11.55 46.37,11.55
  Bottom 0.152: J2.4 39.75,2.54 38.58,3.71 37.69,3.71 37.34,4.06 37.34,4.57 v39.37,6.6 | v39.37,6.6
P4_PC4
  Top 0.152: U8.32 42.72,3 J5.1
P5_PC5
  Top 0.152: U8.33 43.34,4.73 43.34,4.16 44.96,2.54 J5.2
P6_PB0
  Top 0.152: U8.34 43.84,4.73 43.84,4.16 44.29,3.71 46.2,3.71 47.37,2.54 J5.3
P7_PB1
  Top 0.152: U8.35 44.34,4.73 44.34,4.16 44.48,4.01 47.5,4.01 48.44,4.01 49.91,2.54 J5.4
P8_PD14
  Top 0.152: U8.61 57.13,11.7 58.17,10.67 58.17,6.32 57.81,5.96 57.81,4.47 57.05,3.71 55.4,3.71 54.23,2.54 J10.1
P9_PD15
  Top 0.152: J10.2 56.31,2.54 58.12,4.35 58.12,5.84 58.47,6.19 58.47,10.79 57.26,12.01 54.54,12.01 54.35,12.2 U8.62
P10_PC6
  Top 0.152: J10.3 58.78,2.9 58.78,4.1 58.42,4.45 58.42,5.71 58.78,6.06 58.78,10.92 57.39,12.31 54.67,12.31 54.57,12.41 54.28,12.7 U8.63
P11_PC7
  Top 0.152: J10.4 59.64,3.86 59.44,3.86 58.73,4.58 58.73,5.58 59.08,5.94 59.08,11.05 58.18,11.95 57.51,12.61 54.8,12.61 54.21,13.2 U8.64
P12_PC8
  Top 0.152: J10.5 62.61,2.54 61.44,3.71 60.38,3.71 59.92,4.17 59.57,4.17 59.03,4.7 59.03,5.46 59.38,5.81 59.38,11.17 | U8.65 54.14,13.7 54.4,13.45 54.4,13.44 54.92,12.92 57.64,12.92 59.38,11.17 | 59.38,11.17
P13_PC9
  Top 0.152: J10.6 65.15,2.54 63.68,4.01 60.5,4.01 60.04,4.47 59.69,4.47 59.34,4.83 59.34,5.33 59.69,5.68 59.69,11.3 | U8.66 54.14,14.2 54.7,13.64 54.7,13.57 55.05,13.22 57.77,13.22 59.69,11.3 | 59.69,11.3
PG_PD7  (via drill 0.3)
  Top 0.152: v29.21,20.07 29.21,20.7 32.54,24.03 36.4,24.03 36.59,24.22 37.07,24.22 37.26,24.03 41.4,24.03 | U8.88 45.72,19.59 v45.45,19.32 | 41.4,24.03 41.52,24.03 | 41.4,24.03 43.66,24.03 44.06,23.63 v44.45,23.63 | 14.6,16.28 14.78,16.09 v17.06,16.09
  Top 0.305: R5.1 12.47,10.4 13.68,11.61 13.68,13.29 14.6,14.2 14.6,16.28 14.04,16.84 14.04,17.14 13.17,18.01 U7.8
  Bottom 0.152: v29.21,20.07 28.85,19.71 27.52,19.71 26.85,19.04 26.85,18.49 26.72,18.36 24.69,18.36 24.37,18.68 23.87,18.68 23.24,18.06 23.14,18.06 21.84,16.76 18.54,16.76 17.87,16.09 v17.06,16.09 | v44.45,23.63 44.45,22.17 44.24,21.96 44.24,20.53 v45.45,19.32
PIN7  (1 unrouted)
PIN8  (1 unrouted)
PIN21  (1 unrouted)
PIN22  (1 unrouted)
PIN23  (1 unrouted)
PIN24  (1 unrouted)
RX5_PD0
  Top 0.152: J9.2 49.22,21.9 U8.81
RX7_PE7  (via drill 0.3)
  Top 0.152: v45.21,7.62 v45.22,7.61 U8.37 | v31.41,3.76 31.41,6.18 v31.37,6.22
  Bottom 0.152: J11.1 2.96,14.84 1.97,13.85 1.97,9.03 3.58,7.42 26.5,7.42 26.62,7.29 30.35,7.29 30.35,7.24 v31.37,6.22 | v45.21,7.62 41.06,7.62 40.58,8.1 38.75,8.1 37.64,6.99 37.64,6.6 35.36,4.32 31.97,4.32 v31.41,3.76
SCL1_PA5  (via drill 0.3)
  Top 0.152: U8.29 41.22,5.57 v40.81,5.98 | v48.77,5.98 48.23,6.52 48.23,9.11 48.3,9.18 48.3,10.29 v48.59,10.57 | v40.89,18.29 40.89,18.22 41.86,17.26 41.86,16.4 40.89,15.44 40.89,12.8 41.76,11.94 41.76,10.94 42.16,10.53 v42.16,10.32 | U5.8 62.77,5.18 v62.33,5.18
  Bottom 0.152: v40.81,5.98 41.42,5.37 42.88,5.37 43.25,5.74 48.26,5.74 48.53,5.74 v48.77,5.98 48.77,6.35 49.44,7.02 50.78,7.02 51.3,7.54 51.3,7.76 51.56,8.03 57.91,8.03 58.42,8.03 60.33,6.12 60.33,5.69 60.84,5.18 | 60.84,5.18 60.96,5.18 | 60.96,5.18 v62.33,5.18 | J8.1 39.62,21.34 39.95,21.34 40.89,20.4 v40.89,18.29 | v48.59,10.57 48.51,10.49 47.73,10.49 47.28,10.95 46.8,10.95 46.38,10.52 | 46.35,10.49 46.38,10.52 | v42.16,10.32 46.17,10.32 46.38,10.52 | 60.84,5.18 60.96,5.18
SCL1_PB8  (via drill 0.3)
  Top 0.152: R2.1 18.29,4.57 21.34,1.52 23.54,1.52 24.6,2.58 27.04,2.58 27.17,2.71 27.17,2.9 U1.19 27.29,4.18 v27.31,4.2 | v26.42,16.26 27.12,16.96 27.55,16.96 28.02,17.43 29.21,17.43 33.02,21.24 J1.1 | U8.95 42.1,20.67 42.1,21.25 41.66,21.68 41.09,21.68 41.08,21.69 37.62,21.69 36.93,22.38 36.93,23.53 v36.83,23.63 | v28.9,3.94 29.05,4.09 29.05,5.6 28.81,5.84 28.81,6.62 29.05,6.87 29.05,8.02 28.65,8.42 27.85,8.42 27.25,9.02 24.97,9.02 v24.39,9.6
  Top 0.305: R2.1 18.05,4.57
  Bottom 0.152: v26.42,16.26 27.31,15.36 27.31,12.83 27.31,12.52 25.47,10.68 25.47,10.17 25.13,9.83 24.62,9.83 v24.39,9.6 | v36.83,23.63 36.44,23.63 36.04,24.03 34.19,24.03 J1.1 | v28.9,3.94 27.57,3.94 v27.31,4.2
SCL2_PB13  (via drill 0.3)
  Top 0.152: U8.52 52.92,7.2 51.91,8.22 | 51.91,8.22 51.9,8.22 | v50.19,9.49 50.69,9.49 50.78,9.4 50.78,9.22 51.78,8.22 51.9,8.22 | 51.9,8.22 51.91,8.22
  Bottom 0.152: J11.3 3.97,10.43 3.97,9.03 4.97,8.03 26.75,8.03 26.87,7.9 31.61,7.9 31.86,8.16 37.52,8.16 38.38,9.02 40.95,9.02 41.23,8.74 44.65,8.74 44.72,8.81 45.71,8.81 45.78,8.74 47,8.74 47.43,9.17 47.53,9.17 47.76,9.39 48.08,9.39 48.1,9.38 50.08,9.38 v50.19,9.49
SCL3_PC10  (via drill 0.3)
  Top 0.152: v50.18,17.38 50.72,17.92 U8.78 | v58.17,16.36 58.85,15.67 58.85,15.13 60.72,13.26 64.69,13.26 65.12,13.69 U4.8
  Bottom 0.152: v50.18,17.38 51.63,17.38 52.65,16.36 v58.17,16.36
SCL4_PD12  (via drill 0.3)
  Top 0.152: v27.43,18.8 27.42,18.78 U3.19 27.3,17.89 27.3,17.7 27.16,17.57 24.73,17.57 23.67,16.51 22.08,16.51 22.02,16.56 20.36,16.56 18.13,18.8 | U8.59 52.66,10.7 52.46,10.5 v52.32,10.5
  Top 0.305: R10.1 18.13,18.8
  Bottom 0.152: v27.43,18.8 27.69,19.05 28.61,19.05 28.96,19.4 29.46,19.4 30.37,18.49 36.52,18.49 38.75,16.26 38.94,16.26 41.02,14.17 51.99,14.17 52.93,13.23 52.93,11.15 52.32,10.55 v52.32,10.5
SCL4_PE2  (via drill 0.3)
  Top 0.152: v41.27,17.02 39.59,18.7 U8.1
  Bottom 0.152: J43.5 69.95,14.62 69.58,14.62 69.13,15.07 68.89,15.07 68.52,15.44 59.45,15.44 59.15,15.14 57.66,15.14 57.36,15.44 42.85,15.44 v41.27,17.02
SDA1_PB9  (via drill 0.3)
  Top 0.152: R1.1 19.64,2.79 21.21,1.22 23.67,1.22 24.73,2.28 27.3,2.28 U1.20 28.23,3.21 28.45,3.21 | 28.45,3.21 28.46,3.21 | v27.43,16.26 28.3,17.12 29.33,17.12 35.07,22.86 J1.2 36.32,22.86 36.63,22.55 36.63,22.25 37.5,21.38 41.47,21.38 41.6,21.25 41.6,20.67 U8.96 | 28.45,3.21 28.46,3.21 | 28.46,3.21 28.59,3.33 29.15,3.33 29.5,3.69 29.5,4.25 29.63,4.37 29.63,5.47 29.77,5.62 29.47,5.62 29.11,5.97 29.11,6.5 29.63,7.01 29.63,7.97 29.76,8.11 31.2,8.11 31.77,8.68 v31.77,9.88
  Bottom 0.152: 28.55,15.49 28.5,15.54 | 28.5,15.54 28.19,15.85 27.84,15.85 v27.43,16.26 | 28.5,15.54 28.55,15.49 | 28.55,15.49 28.55,11.81 29.41,10.95 29.97,10.95 30.41,10.51 30.41,10.43 30.75,10.09 31.57,10.09 v31.77,9.88
SDA4_PD13  (via drill 0.3)
  Top 0.152: 20.78,16.26 20.83,16.26 | 20.83,16.26 21.89,16.26 21.95,16.2 23.8,16.2 24.85,17.26 27.42,17.26 U3.20 28.35,18.19 28.59,18.19 29.19,18.8 v29.21,18.8 | R9.1 19.48,17.02 20.24,16.26 20.83,16.26 | v52.07,11.38 52.25,11.2 U8.60
  Bottom 0.152: v52.07,11.38 52.63,11.94 52.63,13.11 51.87,13.87 40.9,13.87 38.81,15.95 38.62,15.95 36.39,18.19 30,18.19 29.83,18.36 29.64,18.36 v29.21,18.8
ST_PC3  (via drill 0.3)
  Top 0.152: U2.2 22.2,14.15 22.2,14.29 22.07,14.43 20.96,14.43 20.7,14.17 20.18,14.17 19.86,14.49 v19.82,14.49 | v36.76,10.59 37.16,10.2 U8.18
  Bottom 0.152: v19.82,14.49 20.58,14.49 21.61,15.52 24.35,15.52 25.67,16.84 29.2,16.84 29.54,16.5 29.54,16.02 28.85,15.33 28.85,11.94 29.54,11.25 33.17,11.25 33.36,11.06 36.07,11.06 36.29,11.06 v36.76,10.59
SWDIO_PA13
  Top 0.152: U8.72 53.45,17.32 52.88,17.32 52.74,17.45 52.74,18.95 54.51,20.71 54.51,23.34 53.82,24.03 52.86,24.03 51.69,22.86 J4.1
SWSLK_PA14
  Top 0.152: J4.2 53.34,22.17 U8.76
TX5_PD1
  Top 0.152: J9.1 46.41,22.86 47.89,21.38 48.47,21.38 48.6,21.25 48.6,20.67 U8.82
TX7_PE8  (via drill 0.3)
  Top 0.152: U8.38 45.72,7.22 46.55,8.05 46.74,8.05 47.24,8.56 | 47.24,8.64 47.24,8.56 | v47.04,10.36 47.04,9.97 47.24,9.77 47.24,8.56
  Bottom 0.152: v47.04,10.36 46.33,9.65 46.16,9.65 46.08,9.73 44.27,9.73 44.2,9.65 41.61,9.65 41.33,9.93 38.61,9.93 | 38.61,9.93 38.6,9.93 | 38.61,9.93 38,9.93 37.21,9.14 33.84,9.14 33.77,9.07 31.48,9.07 31.23,8.82 27.25,8.82 27.13,8.94 7.89,8.94 5.95,10.88 5.95,11.85 5.35,12.45 4.55,12.45 3.97,13.03 3.97,13.85 4.96,14.84 J11.5
USB_5V  (via drill 0.3)
  Top 0.152: R13.1 69.72,4.83 69.52,4.62 68.66,4.62 68.38,4.89 68.38,5.78 69.12,6.51 R8.2
  Top 0.305: U9.2 U20.2 U22.2 68.82,16.36 69.43,16.36 69.83,15.96 69.83,13.72 69.83,13.53 70.26,13.1 70.95,13.1 J12.1 72.09,12.98 v72.19,12.88 | v70.36,7.62 70.1,7.37 R8.2
  Top 0.508: v40.29,19.05 40.55,19.05 40.57,19.07 43.04,19.07 43.06,19.05 v43.43,19.05 43.43,18.68 43.5,18.61 43.5,17.96 44.34,17.11 45.44,17.11 45.88,16.67 45.88,15.91 45.03,15.06 45.03,13.31 v45.13,13.21 | U9.2 68.58,19.65 68.58,20.08 67.58,21.08 v55.12,21.08 | v52.83,20.27 52.83,19.72 52.26,19.14 52.26,13.79 51.67,13.21 v50.8,13.21
  Bottom 0.305: v70.36,7.62 71.33,8.59 71.49,8.59 72.94,10.04 72.94,12.13 v72.19,12.87 v72.19,12.88
  Bottom 0.508: v40.29,19.05 37.82,21.51 32.46,21.51 31.3,22.68 20.48,22.68 20.41,22.61 13.33,22.61 11.99,23.95 10.87,23.95 9.53,22.61 J16.3 | v55.12,21.08 54.3,20.27 v52.83,20.27 | v45.13,13.21 v50.8,13.21
USBD+_PB3  (via drill 0.3)
  Top 0.152: U8.89 45.29,20.62 45.29,21.37 45.58,21.66 v46.56,21.66 | v59.18,20.07 59.57,20.07 59.58,20.07 64.82,20.07 65.02,19.86 66.78,19.86 v67.06,20.14 | v66.21,18.12 66.3,18.03 U20.1
  Top 0.305: U24.2 68.68,13.05 68.33,12.7 67.1,12.7 66.5,13.31 v66.5,14.23 66.5,16.56 U20.1 | J12.3 72.09,11.68 v72.25,11.85
  Bottom 0.152: v46.56,21.66 47.08,21.13 52.41,21.13 52.45,21.18 53.21,21.18 53.26,21.13 53.88,21.13 54.71,21.97 54.71,23.11 54.71,23.34 55.4,24.03 56.36,24.03 57.05,23.34 57.05,21.79 58.02,20.82 58.41,20.82 58.66,20.57 | 58.66,20.57 58.67,20.57 | 58.66,20.57 59.16,20.07 v59.18,20.07 | v67.06,20.14 67.06,19.92 66.3,19.16 66.3,18.21 v66.21,18.12
  Bottom 0.305: v66.5,14.23 66.89,14.23 66.91,14.25 67.46,14.25 67.84,13.86 67.84,12.53 69.37,11 69.37,9.23 69.55,9.05 71.3,9.05 71.48,9.23 71.48,11.07 v72.25,11.85
USBD-_PB4  (via drill 0.3)
  Top 0.152: U9.1 64.9,19.56 64.69,19.76 59.7,19.76 59.42,19.48 58.94,19.48 58.66,19.76 58.64,19.76 v58.17,20.24 | U8.90 44.72,21.62 v44.82,21.72
  Top 0.305: v67.18,18.8 67.94,19.56 U9.1 | U23.2 68.68,15.21 | J12.2 70.95,12.45 70.26,12.45 69.18,13.53 69.18,13.94 68.68,14.44 U23.2 | U23.2 68.68,15.21 | 68.68,15.21 v69.14,15.68
  Bottom 0.152: v58.17,20.24 56.72,21.69 54.86,21.69 54,20.83 53.13,20.83 53.08,20.87 52.58,20.87 52.53,20.83 46.23,20.83 45.71,20.83 v44.82,21.72
  Bottom 0.305: v67.18,18.8 67.18,17.64 v69.14,15.68
USBSENSE_PB5  (via drill 0.3)
  Top 0.152: v66.55,7.37 R8.1 67.54,7.82 R7.2 | U8.91 44.22,18.54 45.03,17.73 v46.41,17.73 | v49.96,16.36 49.96,13.21 49.98,13.21 50.56,12.63 50.87,12.63 51.46,12.04 51.46,10.53 52.2,9.8 v52.2,9.53
  Bottom 0.152: v66.55,7.37 65.79,8.13 65.79,10.41 65.53,10.67 65.28,10.92 53.59,10.92 v52.2,9.53 | v46.41,17.73 47.78,16.36 v49.96,16.36
VIN  (via drill 0.3)
  Top 0.305: R15.1 9.91,4.32 7.62,6.6
  Top 0.508: v7.87,10.16 7.62,9.91 7.62,6.6 7.62,6.58 6.08,5.04 6.08,3.6 6.32,3.36 8.83,3.36 v9.91,2.29
  Bottom 0.508: J16.1 12.78,21.26 12.78,19.51 11.99,18.72 10.24,18.72 7.87,16.36 v7.87,10.16 | J13.1 29.72,3.3 29.37,3.3 29.22,3.15 28.57,3.15 28.42,3.3 10.92,3.3 v9.91,2.29
XIN32  (1 unrouted)
XOUT_PC0  (via drill 0.3)
  Top 0.152: 17.78,11.95 C16.1 19.54,13.45 U2.5 20.68,13.33 20.09,13.33 19.46,12.7 19.46,12.49 v19.16,12.19 | U8.15 39.13,11.7 v39.62,12.19
  Bottom 0.152: v19.16,12.19 19.16,13.01 18.32,13.85 18.32,14.53 19.92,16.13 24.09,16.13 25.41,17.45 29.45,17.45 30.15,16.75 30.15,15.76 29.51,15.12 29.51,14.36 29.52,14.35 29.52,12.14 29.79,11.86 31.78,11.86 32.69,12.77 33.17,12.77 34.08,11.86 39.29,11.86 v39.62,12.19
YOUT_PC1  (via drill 0.3)
  Top 0.152: 17.78,13.71 C15.1 18.8,13.46 | 18.8,13.46 19.12,13.46 19.47,13.8 21.15,13.8 U2.4 | 18.8,13.46 18.8,13.97 v18.93,14.1 | U8.16 37.99,11.32 39.67,11.32 40.06,11.71 v40.43,11.71
  Bottom 0.152: v18.93,14.1 18.93,14.2 19.09,14.36 19.09,14.87 20.04,15.82 24.22,15.82 25.54,17.14 29.32,17.14 29.84,16.62 29.84,15.89 29.2,15.25 29.2,14.23 29.21,14.22 29.21,12.01 29.67,11.55 33.3,11.55 33.48,11.38 39.73,11.38 39.8,11.45 40.16,11.45 v40.43,11.71
ZOUT_PC2  (via drill 0.3)
  Top 0.152: U2.16 23.4,14.27 23.14,14.53 22.43,14.53 22.15,14.8 22.15,15.57 21.77,15.95 20.91,15.95 20.8,15.85 19.2,15.85 v18.95,16.1 18.95,15.49 18.95,15.34 18.86,15.24 C8.1 | v40.05,10.84 | v40.05,10.84 38.58,10.84 38.44,10.7 U8.17
  Bottom 0.152: v18.95,16.1 19.46,16.1 19.79,16.43 23.97,16.43 25.29,17.75 29.58,17.75 30.49,16.84 31.23,16.84 31.57,16.5 31.57,16.02 31.23,15.67 30.49,15.67 29.82,15 29.82,12.26 31.75,12.26 32.56,13.07 33.3,13.07 34.17,12.19 38.14,12.19 38.87,12.92 39.75,12.92 40.38,12.29 41.4,12.29 41.76,11.94 41.76,11.43 41.4,11.08 40.29,11.08 v40.05,10.84

## Text on the board
tPlace: NOTES: / Via drill: 0.3mm / Via Hole: Auto / Ground plane on bottom / Pow plane on top / All power inputs should pass through caps first (i.e. use cutout polys)